# Altium schematic sheet [04] - RGB LED MATRIX.SchDoc
size A4; Date: 07/05/2016; CheckedBy: Javier Guillemat; Author: Javier Jiménez; CompanyName: Guilletronic; Organization: Guilletronic; Address1: Calle del Cel Nº14; Address2: Las Colinas; Address3: 08818 Olivella; DocumentNumber: 4; Revision: A; SheetNumber: 4; SheetTotal: 6
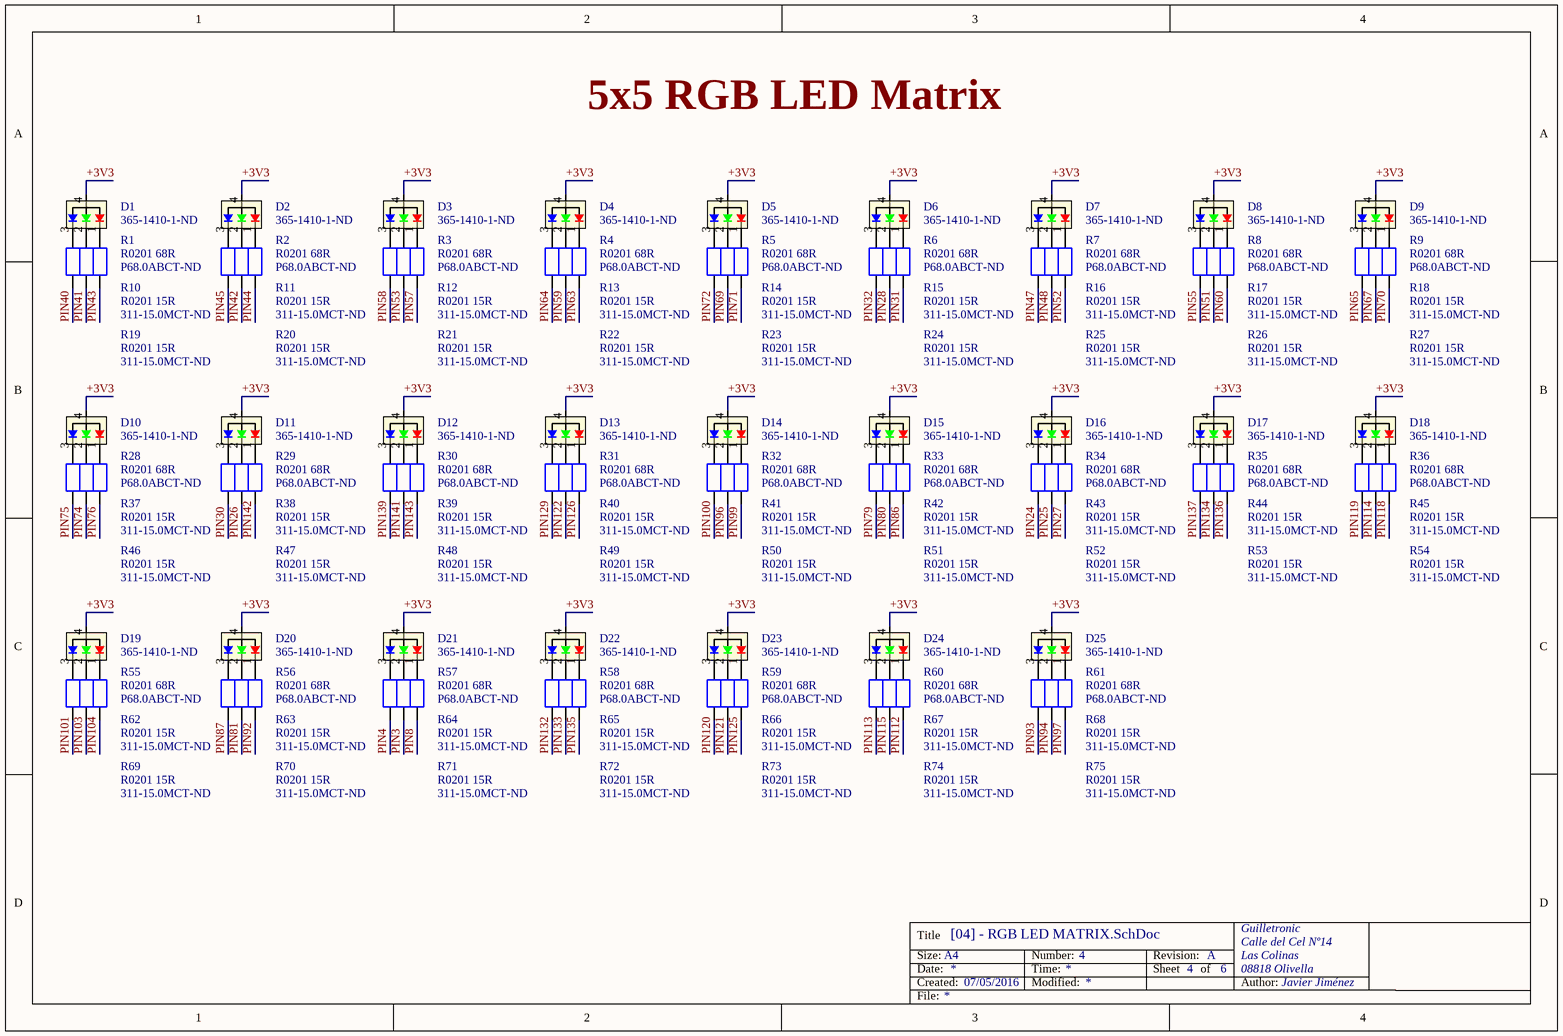
[diagram p0: [04] - RGB LED MATRIX.SchDoc]

## Parts
D1  Supplier Part Number 1: 365-1410-1-ND  [LED RGB]  (hidden comment: LED RGB)
D2  Supplier Part Number 1: 365-1410-1-ND  [LED RGB]  (hidden comment: LED RGB)
D3  Supplier Part Number 1: 365-1410-1-ND  [LED RGB]  (hidden comment: LED RGB)
D4  Supplier Part Number 1: 365-1410-1-ND  [LED RGB]  (hidden comment: LED RGB)
D5  Supplier Part Number 1: 365-1410-1-ND  [LED RGB]  (hidden comment: LED RGB)
D6  Supplier Part Number 1: 365-1410-1-ND  [LED RGB]  (hidden comment: LED RGB)
D7  Supplier Part Number 1: 365-1410-1-ND  [LED RGB]  (hidden comment: LED RGB)
D8  Supplier Part Number 1: 365-1410-1-ND  [LED RGB]  (hidden comment: LED RGB)
D9  Supplier Part Number 1: 365-1410-1-ND  [LED RGB]  (hidden comment: LED RGB)
D10  Supplier Part Number 1: 365-1410-1-ND  [LED RGB]  (hidden comment: LED RGB)
D11  Supplier Part Number 1: 365-1410-1-ND  [LED RGB]  (hidden comment: LED RGB)
D12  Supplier Part Number 1: 365-1410-1-ND  [LED RGB]  (hidden comment: LED RGB)
D13  Supplier Part Number 1: 365-1410-1-ND  [LED RGB]  (hidden comment: LED RGB)
D14  Supplier Part Number 1: 365-1410-1-ND  [LED RGB]  (hidden comment: LED RGB)
D15  Supplier Part Number 1: 365-1410-1-ND  [LED RGB]  (hidden comment: LED RGB)
D16  Supplier Part Number 1: 365-1410-1-ND  [LED RGB]  (hidden comment: LED RGB)
D17  Supplier Part Number 1: 365-1410-1-ND  [LED RGB]  (hidden comment: LED RGB)
D18  Supplier Part Number 1: 365-1410-1-ND  [LED RGB]  (hidden comment: LED RGB)
D19  Supplier Part Number 1: 365-1410-1-ND  [LED RGB]  (hidden comment: LED RGB)
D20  Supplier Part Number 1: 365-1410-1-ND  [LED RGB]  (hidden comment: LED RGB)
D21  Supplier Part Number 1: 365-1410-1-ND  [LED RGB]  (hidden comment: LED RGB)
D22  Supplier Part Number 1: 365-1410-1-ND  [LED RGB]  (hidden comment: LED RGB)
D23  Supplier Part Number 1: 365-1410-1-ND  [LED RGB]  (hidden comment: LED RGB)
D24  Supplier Part Number 1: 365-1410-1-ND  [LED RGB]  (hidden comment: LED RGB)
D25  Supplier Part Number 1: 365-1410-1-ND  [LED RGB]  (hidden comment: LED RGB)
R1  R0201 68R  Supplier Part Number 1: P68.0ABCT-ND  [R0201]
R2  R0201 68R  Supplier Part Number 1: P68.0ABCT-ND  [R0201]
R3  R0201 68R  Supplier Part Number 1: P68.0ABCT-ND  [R0201]
R4  R0201 68R  Supplier Part Number 1: P68.0ABCT-ND  [R0201]
R5  R0201 68R  Supplier Part Number 1: P68.0ABCT-ND  [R0201]
R6  R0201 68R  Supplier Part Number 1: P68.0ABCT-ND  [R0201]
R7  R0201 68R  Supplier Part Number 1: P68.0ABCT-ND  [R0201]
R8  R0201 68R  Supplier Part Number 1: P68.0ABCT-ND  [R0201]
R9  R0201 68R  Supplier Part Number 1: P68.0ABCT-ND  [R0201]
R10  R0201 15R  Supplier Part Number 1: 311-15.0MCT-ND  [R0201]
R11  R0201 15R  Supplier Part Number 1: 311-15.0MCT-ND  [R0201]
R12  R0201 15R  Supplier Part Number 1: 311-15.0MCT-ND  [R0201]
R13  R0201 15R  Supplier Part Number 1: 311-15.0MCT-ND  [R0201]
R14  R0201 15R  Supplier Part Number 1: 311-15.0MCT-ND  [R0201]
R15  R0201 15R  Supplier Part Number 1: 311-15.0MCT-ND  [R0201]
R16  R0201 15R  Supplier Part Number 1: 311-15.0MCT-ND  [R0201]
R17  R0201 15R  Supplier Part Number 1: 311-15.0MCT-ND  [R0201]
R18  R0201 15R  Supplier Part Number 1: 311-15.0MCT-ND  [R0201]
R19  R0201 15R  Supplier Part Number 1: 311-15.0MCT-ND  [R0201]
R20  R0201 15R  Supplier Part Number 1: 311-15.0MCT-ND  [R0201]
R21  R0201 15R  Supplier Part Number 1: 311-15.0MCT-ND  [R0201]
R22  R0201 15R  Supplier Part Number 1: 311-15.0MCT-ND  [R0201]
R23  R0201 15R  Supplier Part Number 1: 311-15.0MCT-ND  [R0201]
R24  R0201 15R  Supplier Part Number 1: 311-15.0MCT-ND  [R0201]
R25  R0201 15R  Supplier Part Number 1: 311-15.0MCT-ND  [R0201]
R26  R0201 15R  Supplier Part Number 1: 311-15.0MCT-ND  [R0201]
R27  R0201 15R  Supplier Part Number 1: 311-15.0MCT-ND  [R0201]
R28  R0201 68R  Supplier Part Number 1: P68.0ABCT-ND  [R0201]
R29  R0201 68R  Supplier Part Number 1: P68.0ABCT-ND  [R0201]
R30  R0201 68R  Supplier Part Number 1: P68.0ABCT-ND  [R0201]
R31  R0201 68R  Supplier Part Number 1: P68.0ABCT-ND  [R0201]
R32  R0201 68R  Supplier Part Number 1: P68.0ABCT-ND  [R0201]
R33  R0201 68R  Supplier Part Number 1: P68.0ABCT-ND  [R0201]
R34  R0201 68R  Supplier Part Number 1: P68.0ABCT-ND  [R0201]
R35  R0201 68R  Supplier Part Number 1: P68.0ABCT-ND  [R0201]
R36  R0201 68R  Supplier Part Number 1: P68.0ABCT-ND  [R0201]
R37  R0201 15R  Supplier Part Number 1: 311-15.0MCT-ND  [R0201]
R38  R0201 15R  Supplier Part Number 1: 311-15.0MCT-ND  [R0201]
R39  R0201 15R  Supplier Part Number 1: 311-15.0MCT-ND  [R0201]
R40  R0201 15R  Supplier Part Number 1: 311-15.0MCT-ND  [R0201]
R41  R0201 15R  Supplier Part Number 1: 311-15.0MCT-ND  [R0201]
R42  R0201 15R  Supplier Part Number 1: 311-15.0MCT-ND  [R0201]
R43  R0201 15R  Supplier Part Number 1: 311-15.0MCT-ND  [R0201]
R44  R0201 15R  Supplier Part Number 1: 311-15.0MCT-ND  [R0201]
R45  R0201 15R  Supplier Part Number 1: 311-15.0MCT-ND  [R0201]
R46  R0201 15R  Supplier Part Number 1: 311-15.0MCT-ND  [R0201]
R47  R0201 15R  Supplier Part Number 1: 311-15.0MCT-ND  [R0201]
R48  R0201 15R  Supplier Part Number 1: 311-15.0MCT-ND  [R0201]
R49  R0201 15R  Supplier Part Number 1: 311-15.0MCT-ND  [R0201]
R50  R0201 15R  Supplier Part Number 1: 311-15.0MCT-ND  [R0201]
R51  R0201 15R  Supplier Part Number 1: 311-15.0MCT-ND  [R0201]
R52  R0201 15R  Supplier Part Number 1: 311-15.0MCT-ND  [R0201]
R53  R0201 15R  Supplier Part Number 1: 311-15.0MCT-ND  [R0201]
R54  R0201 15R  Supplier Part Number 1: 311-15.0MCT-ND  [R0201]
R55  R0201 68R  Supplier Part Number 1: P68.0ABCT-ND  [R0201]
R56  R0201 68R  Supplier Part Number 1: P68.0ABCT-ND  [R0201]
R57  R0201 68R  Supplier Part Number 1: P68.0ABCT-ND  [R0201]
R58  R0201 68R  Supplier Part Number 1: P68.0ABCT-ND  [R0201]
R59  R0201 68R  Supplier Part Number 1: P68.0ABCT-ND  [R0201]
R60  R0201 68R  Supplier Part Number 1: P68.0ABCT-ND  [R0201]
R61  R0201 68R  Supplier Part Number 1: P68.0ABCT-ND  [R0201]
R62  R0201 15R  Supplier Part Number 1: 311-15.0MCT-ND  [R0201]
R63  R0201 15R  Supplier Part Number 1: 311-15.0MCT-ND  [R0201]
R64  R0201 15R  Supplier Part Number 1: 311-15.0MCT-ND  [R0201]
R65  R0201 15R  Supplier Part Number 1: 311-15.0MCT-ND  [R0201]
R66  R0201 15R  Supplier Part Number 1: 311-15.0MCT-ND  [R0201]
R67  R0201 15R  Supplier Part Number 1: 311-15.0MCT-ND  [R0201]
R68  R0201 15R  Supplier Part Number 1: 311-15.0MCT-ND  [R0201]
R69  R0201 15R  Supplier Part Number 1: 311-15.0MCT-ND  [R0201]
R70  R0201 15R  Supplier Part Number 1: 311-15.0MCT-ND  [R0201]
R71  R0201 15R  Supplier Part Number 1: 311-15.0MCT-ND  [R0201]
R72  R0201 15R  Supplier Part Number 1: 311-15.0MCT-ND  [R0201]
R73  R0201 15R  Supplier Part Number 1: 311-15.0MCT-ND  [R0201]
R74  R0201 15R  Supplier Part Number 1: 311-15.0MCT-ND  [R0201]
R75  R0201 15R  Supplier Part Number 1: 311-15.0MCT-ND  [R0201]

## Nets
+3V3: D1.4(ANODE) D2.4(ANODE) D3.4(ANODE) D4.4(ANODE) D5.4(ANODE) D6.4(ANODE) D7.4(ANODE) D8.4(ANODE) D9.4(ANODE) D10.4(ANODE) D11.4(ANODE) D12.4(ANODE) D13.4(ANODE) D14.4(ANODE) D15.4(ANODE) D16.4(ANODE) D17.4(ANODE) D18.4(ANODE) D19.4(ANODE) D20.4(ANODE) D21.4(ANODE) D22.4(ANODE) D23.4(ANODE) D24.4(ANODE) D25.4(ANODE)
PIN3: R64.2
PIN4: R71.2
PIN8: R57.2
PIN24: R52.2
PIN25: R43.2
PIN26: R38.2
PIN27: R34.2
PIN28: R15.2
PIN30: R47.2
PIN31: R6.2
PIN32: R24.2
PIN40: R19.2
PIN41: R10.2
PIN42: R11.2
PIN43: R1.2
PIN44: R2.2
PIN45: R20.2
PIN47: R25.2
PIN48: R16.2
PIN51: R17.2
PIN52: R7.2
PIN53: R12.2
PIN55: R26.2
PIN57: R3.2
PIN58: R21.2
PIN59: R13.2
PIN60: R8.2
PIN63: R4.2
PIN64: R22.2
PIN65: R27.2
PIN67: R18.2
PIN69: R14.2
PIN70: R9.2
PIN71: R5.2
PIN72: R23.2
PIN74: R37.2
PIN75: R46.2
PIN76: R28.2
PIN79: R51.2
PIN80: R42.2
PIN81: R63.2
PIN86: R33.2
PIN87: R70.2
PIN92: R56.2
PIN93: R75.2
PIN94: R68.2
PIN96: R41.2
PIN97: R61.2
PIN99: R32.2
PIN100: R50.2
PIN101: R69.2
PIN103: R62.2
PIN104: R55.2
PIN112: R60.2
PIN113: R74.2
PIN114: R45.2
PIN115: R67.2
PIN118: R36.2
PIN119: R54.2
PIN120: R73.2
PIN121: R66.2
PIN122: R40.2
PIN125: R59.2
PIN126: R31.2
PIN129: R49.2
PIN132: R72.2
PIN133: R65.2
PIN134: R44.2
PIN135: R58.2
PIN136: R35.2
PIN137: R53.2
PIN139: R48.2
PIN141: R39.2
PIN142: R29.2
PIN143: R30.2
NetD1_1: D1.1(R) R1.1
NetD1_2: D1.2(G) R10.1
NetD1_3: D1.3(B) R19.1
NetD2_1: D2.1(R) R2.1
NetD2_2: D2.2(G) R11.1
NetD2_3: D2.3(B) R20.1
NetD3_1: D3.1(R) R3.1
NetD3_2: D3.2(G) R12.1
NetD3_3: D3.3(B) R21.1
NetD4_1: D4.1(R) R4.1
NetD4_2: D4.2(G) R13.1
NetD4_3: D4.3(B) R22.1
NetD5_1: D5.1(R) R5.1
NetD5_2: D5.2(G) R14.1
NetD5_3: D5.3(B) R23.1
NetD6_1: D6.1(R) R6.1
NetD6_2: D6.2(G) R15.1
NetD6_3: D6.3(B) R24.1
NetD7_1: D7.1(R) R7.1
NetD7_2: D7.2(G) R16.1
NetD7_3: D7.3(B) R25.1
NetD8_1: D8.1(R) R8.1
NetD8_2: D8.2(G) R17.1
NetD8_3: D8.3(B) R26.1
NetD9_1: D9.1(R) R9.1
NetD9_2: D9.2(G) R18.1
NetD9_3: D9.3(B) R27.1
NetD10_1: D10.1(R) R28.1
NetD10_2: D10.2(G) R37.1
NetD10_3: D10.3(B) R46.1
NetD11_1: D11.1(R) R29.1
NetD11_2: D11.2(G) R38.1
NetD11_3: D11.3(B) R47.1
NetD12_1: D12.1(R) R30.1
NetD12_2: D12.2(G) R39.1
NetD12_3: D12.3(B) R48.1
NetD13_1: D13.1(R) R31.1
NetD13_2: D13.2(G) R40.1
NetD13_3: D13.3(B) R49.1
NetD14_1: D14.1(R) R32.1
NetD14_2: D14.2(G) R41.1
NetD14_3: D14.3(B) R50.1
NetD15_1: D15.1(R) R33.1
NetD15_2: D15.2(G) R42.1
NetD15_3: D15.3(B) R51.1
NetD16_1: D16.1(R) R34.1
NetD16_2: D16.2(G) R43.1
NetD16_3: D16.3(B) R52.1
NetD17_1: D17.1(R) R35.1
NetD17_2: D17.2(G) R44.1
NetD17_3: D17.3(B) R53.1
NetD18_1: D18.1(R) R36.1
NetD18_2: D18.2(G) R45.1
NetD18_3: D18.3(B) R54.1
NetD19_1: D19.1(R) R55.1
NetD19_2: D19.2(G) R62.1
NetD19_3: D19.3(B) R69.1
NetD20_1: D20.1(R) R56.1
NetD20_2: D20.2(G) R63.1
NetD20_3: D20.3(B) R70.1
NetD21_1: D21.1(R) R57.1
NetD21_2: D21.2(G) R64.1
NetD21_3: D21.3(B) R71.1
NetD22_1: D22.1(R) R58.1
NetD22_2: D22.2(G) R65.1
NetD22_3: D22.3(B) R72.1
NetD23_1: D23.1(R) R59.1
NetD23_2: D23.2(G) R66.1
NetD23_3: D23.3(B) R73.1
NetD24_1: D24.1(R) R60.1
NetD24_2: D24.2(G) R67.1
NetD24_3: D24.3(B) R74.1
NetD25_1: D25.1(R) R61.1
NetD25_2: D25.2(G) R68.1
NetD25_3: D25.3(B) R75.1

## Notes on the sheet
- 5x5 RGB LED Matrix
- Title
- Size:
- Date:
- Created:
- A4
- Number:
- Time:
- Modified:
- Revision:
- Sheet
- of
- Author:
- File:

## Library data of the parts
D1-D25 = LED RGB: LED RGB DIFFUSED 4SMD R/A; Supplier 1: Digi-Key
R1-R9 R28-R36 R55-R61 = R0201 68R: Manufacturer 1: Panasonic Electronic Components; Manufacturer Part Number 1: ERJ-1GEF68R0C; Resistance (Ohms): 68; Tolerance: ±1%; Power (Watts): 0.05W, 1/20W; Temperature Coefficient: ±200ppm/°C; Description 1: RES SMD 68 OHM 1% 1/20W 0201; Category 1: Resistors; Supplier 1: Digi-Key; RoHS: RoHS Compliant; Stock 1: 123824; Pricing 1: 1=0.09, 10=0.049, 25=0.036, 50=0.0272, 100=0.02, 250=0.01528, 500=0.01224, 1000=0.00901, 5000=0.00646 (EUR); Packaging: Cut Tape (CT); Part Status: Active; Composition: Thick Film; Features: -; Operating Temperature: -55°C ~ 125°C; Package / Case: 0201 (0603 Metric); Supplier Device Package: 0201; Size / Dimension: 0.024" L x 0.012" W (0.60mm x 0.30mm); Height - Seated (Max): 0.010" (0.26mm); Failure Rate: -; ComponentLink1URL: http://media.digikey.com/pdf/Data%20Sheets/Panasonic%20Resistors%20Thermistors%20PDFs/ERJ_G,R,E_Rev08.pdf; ComponentLink1Description: http://media.digikey.com/pdf/Data%20Sheets/Panasonic%20Resistors%20Thermistors%20PDFs/ERJ_G,R,E_Rev08.pdf
R10-R27 R37-R54 R62-R75 = R0201 15R: Manufacturer 1: Yageo; Manufacturer Part Number 1: RC0201FR-0715RL; Resistance (Ohms): 15; Tolerance: ±1%; Power (Watts): 0.05W, 1/20W; Temperature Coefficient: ±200ppm/°C; Description 1: RES SMD 15 OHM 1% 1/20W 0201; Category 1: Resistors; Supplier 1: Digi-Key; RoHS: RoHS Compliant; Stock 1: 141540; Pricing 1: 1=0.09, 10=0.047, 25=0.034, 50=0.0258, 100=0.0191, 250=0.01452, 500=0.01164, 1000=0.00855, 5000=0.00613 (EUR); Packaging: Cut Tape (CT); Part Status: Active; Composition: Thick Film; Features: Moisture Resistant; Operating Temperature: -55°C ~ 125°C; Package / Case: 0201 (0603 Metric); Supplier Device Package: 0201; Size / Dimension: 0.024" L x 0.012" W (0.60mm x 0.30mm); Height - Seated (Max): 0.010" (0.26mm); Failure Rate: -; ComponentLink1URL: http://www.yageo.com/documents/recent/PYu-RC_Group_51_RoHS_L_7.pdf; ComponentLink1Description: http://www.yageo.com/documents/recent/PYu-RC_Group_51_RoHS_L_7.pdf